# Altium project REFLOW_Controller.PrjPcb (part 2 of 3)

## Sheet MCU.SchDoc
size A4; SheetNumber: 3; SheetTotal: 5
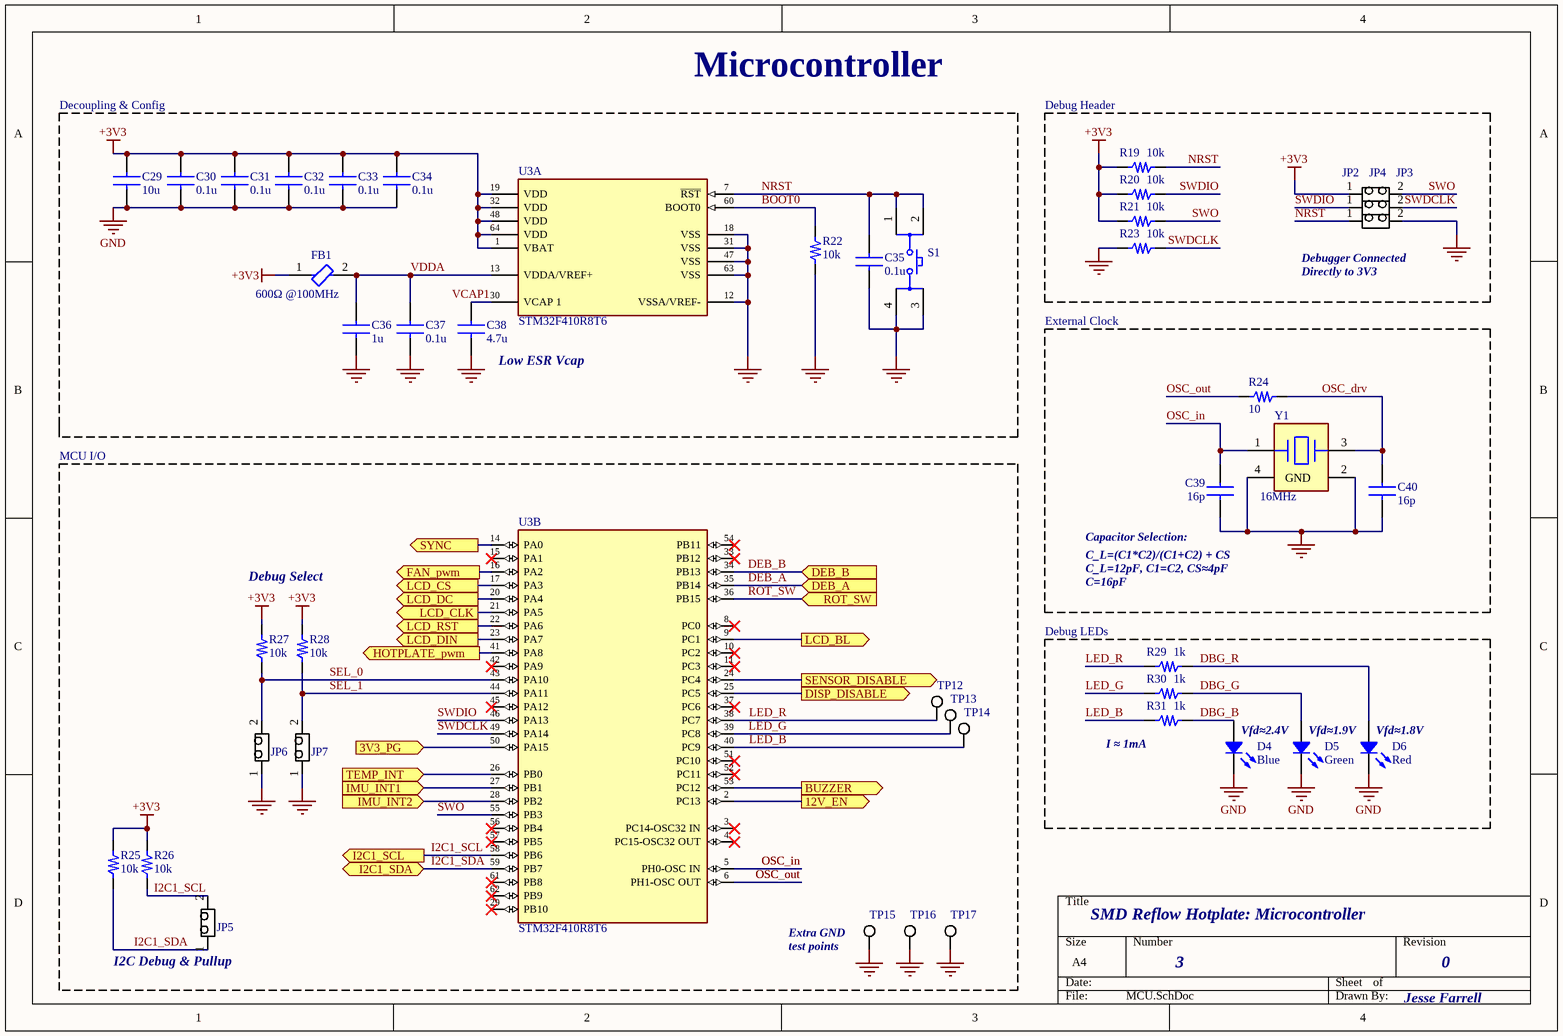
[diagram p2: MCU.SchDoc]

### Parts
C29  10u  [FP-CL10-IPC_C]
C30  0.1u  [FP-CL10-IPC_C]
C31  0.1u  [FP-CL10-IPC_C]
C32  0.1u  [FP-CL10-IPC_C]
C33  0.1u  [FP-CL10-IPC_C]
C34  0.1u  [FP-CL10-IPC_C]
C35  0.1u  [FP-CL10-IPC_C]
C36  1u  [FP-CL10-IPC_C]
C37  0.1u  [FP-CL10-IPC_C]
C38  4.7u  [FP-CL10-IPC_C]
C39  16p  [FP-CL10-IPC_C]
C40  16p  [FP-CL10-IPC_C]
D4  Blue  [LED 0603_1608 BLUE]
D5  Green  [LED 0603_1608 GREEN]
D6  Red  [LED 0603_1608 RED]
FB1  600Ω @100MHz  [FP-BLM18-0_15-t0_8-MFG]
JP2  HDR_1x2  [FP-TSW-102-07-L-S-MFG]  (value not drawn)
JP3  HDR_1x2  [FP-TSW-102-07-L-S-MFG]  (value not drawn)
JP4  HDR_1x2  [FP-TSW-102-07-L-S-MFG]  (value not drawn)
JP5  HDR_1x2  [FP-TSW-102-07-L-S-MFG]  (value not drawn)
JP6  HDR_1x2  [FP-TSW-102-07-L-S-MFG]  (value not drawn)
JP7  HDR_1x2  [FP-TSW-102-07-L-S-MFG]  (value not drawn)
R19  10k  [FP-RMCF0603-MFG]
R20  10k  [FP-RMCF0603-MFG]
R21  10k  [FP-RMCF0603-MFG]
R22  10k  [FP-RMCF0603-MFG]
R23  10k  [FP-RMCF0603-MFG]
R24  10  [FP-RMCF0603-MFG]
R25  10k  [FP-RMCF0603-MFG]
R26  10k  [FP-RMCF0603-MFG]
R27  10k  [FP-RMCF0603-MFG]
R28  10k  [FP-RMCF0603-MFG]
R29  1k  [FP-RMCF0603-MFG]
R30  1k  [FP-RMCF0603-MFG]
R31  1k  [FP-RMCF0603-MFG]
S1  PushButton  [FP-TL3301AF160QG-MFG]  (value not drawn)
TP12  TEST POINT  [KSTN-5003]  (value not drawn)
TP13  TEST POINT  [KSTN-5003]  (value not drawn)
TP14  TEST POINT  [KSTN-5003]  (value not drawn)
TP15  BLCK TEST POINT  [FP-5001-MFG]  (value not drawn)
TP16  BLCK TEST POINT  [FP-5001-MFG]  (value not drawn)
TP17  BLCK TEST POINT  [FP-5001-MFG]  (value not drawn)
U3  STM32F410R8T6  [FP-LQFP64-5W-IPC_B]  (parts A,B of 2)
Y1  16MHz  [FP-8Y-MFG]

### Blocks framed on the sheet
Debug Header: JP2-JP4 R19-R21 R23
Debug LEDs: D4-D6 R29-R31

### Ports
3V3_PG (in), 12V_EN (out), BUZZER (out), DEB_A (in), DEB_B (in), DISP_DISABLE (out), FAN_pwm (out), HOTPLATE_pwm (out), I2C1_SCL (out), I2C1_SDA (bidir), IMU_INT1 (in), IMU_INT2 (in), LCD_BL (out), LCD_CLK (out), LCD_CS (out), LCD_DC (out), LCD_DIN (out), LCD_RST (out), ROT_SW (in), SENSOR_DISABLE (out), SYNC (out), TEMP_INT (in)

### Nets
+3V3: C29.1 C30.1 C31.1 C32.1 C33.1 C34.1 FB1.1 JP2.1 R19.2 R20.2 R21.2 R25.2 R26.2 R27.2 R28.2 U3.1(VBAT) U3.19(VDD) U3.32(VDD) U3.48(VDD) U3.64(VDD)
GND: C29.2 C30.2 C31.2 C32.2 C33.2 C34.2 C35.2 C36.2 C37.2 C38.2 C39.2 C40.2 D4.2 D5.2 D6.2 JP4.2 JP6.1 JP7.1 R22.1 R23.2 S1.3 S1.4 TP15.1 TP16.1 TP17.1 U3.12(VSSA/VREF-) U3.18(VSS) U3.31(VSS) U3.47(VSS) U3.63(VSS) Y1.2(GND) Y1.4(GND)
3V3_PG: U3.50(PA15) ; port 3V3_PG
12V_EN_in: U3.2(PC13) ; port 12V_EN
BOOT0: R22.2 U3.60(BOOT0)
BUZZER: U3.53(PC12) ; port BUZZER
DBG_B: D4.1 R31.1
DBG_G: D5.1 R30.1
DBG_R: D6.1 R29.1
DEB_A: U3.35(PB14) ; port DEB_A
DEB_B: U3.34(PB13) ; port DEB_B
DISP_DBL: U3.25(PC5) ; port DISP_DISABLE
FAN_pwm: U3.16(PA2) ; port FAN_pwm
I2C1_SCL: JP5.2 R26.1 U3.58(PB6) ; port I2C1_SCL
I2C1_SDA: JP5.1 R25.1 U3.59(PB7) ; port I2C1_SDA
IMU_INT1: U3.27(PB1) ; port IMU_INT1
IMU_INT2: U3.28(PB2) ; port IMU_INT2
LCD_BL: U3.9(PC1) ; port LCD_BL
LCD_CLK: U3.21(PA5) ; port LCD_CLK
LCD_CS: U3.17(PA3) ; port LCD_CS
LCD_DC: U3.20(PA4) ; port LCD_DC
LCD_DIN: U3.23(PA7) ; port LCD_DIN
LCD_RST: U3.22(PA6) ; port LCD_RST
LED_B: R31.2 TP14.1 U3.40(PC9)
LED_G: R30.2 TP13.1 U3.39(PC8)
LED_R: R29.2 TP12.1 U3.38(PC7)
NRST: C35.1 JP4.1 R19.1 S1.1 S1.2 U3.7(~{RST})
OSC_drv: C40.1 R24.1 Y1.3
OSC_in: C39.1 U3.5(PH0-OSC_IN) Y1.1
OSC_out: R24.2 U3.6(PH1-OSC_OUT)
PLATE_pwm: U3.41(PA8) ; port HOTPLATE_pwm
ROT_SW: U3.36(PB15) ; port ROT_SW
SEL_0: JP6.2 R27.1 U3.43(PA10)
SEL_1: JP7.2 R28.1 U3.44(PA11)
SNS_DBL: U3.24(PC4) ; port SENSOR_DISABLE
SWDCLK: JP3.2 R23.1 U3.49(PA14)
SWDIO: JP3.1 R20.1 U3.46(PA13)
SWO: JP2.2 R21.1 U3.55(PB3)
SYNC_in: U3.14(PA0) ; port SYNC
TEMP_INT: U3.26(PB0) ; port TEMP_INT
VCAP1: C38.1 U3.30(VCAP_1)
VDDA: C36.1 C37.1 FB1.2 U3.13(VDDA/VREF+)

Not connected (* = marked no-connect by the designer): U3 3(PC14-OSC32_IN)* 4(PC15-OSC32_OUT)* 8(PC0)* 10(PC2)* 11(PC3)* 15(PA1)* 29(PB10)* 33(PB12)* 37(PC6)* 42(PA9)* 45(PA12)* 51(PC10)* 52(PC11)* 54(PB11)* 56(PB4)* 57(PB5)* 61(PB8)* 62(PB9)*

### Notes on the sheet
- Decoupling & Config
- Microcontroller
- Debugger Connected
  Directly to 3V3
- Low ESR Vcap
- External Clock
- MCU I/O
- Debug Select
- (near C39) Capacitor Selection: <https://www.st.com/resource/en/application_note/cd00221665-oscillator-design-guide-for-stm8afals-stm32-mcus-and-mpus-stmicroelectronics.pdf>
- C_L=(C1*C2)/(C1+C2) + CS
  C_L=12pF, C1=C2, CS≈4pF
  C=16pF
- (near R31) I ≈ 1mA
- (near D5) Vfd≈2.4V
- (near D6) Vfd≈1.9V
- (near D6) Vfd≈1.8V
- (near JP5) I2C Debug & Pullup
- (near TP15) Extra GND
  test points
- SMD Reflow Hotplate: Microcontroller
- 3
- 0
- Jesse Farrell

### Library data of the parts
C29 = CapTemplate0603: Cap Ceramic 10uF 16V X5R 10% SMD 0603; Capacitance: 0.1uF; Supplier 1: Digi-Key; RoHS: Yes; Category: Ceramic Capacitors; Mount: Surface Mount; Case/Package: 0603; Case Code (Metric): 1608; Case Code (Imperial): 0603; Packaging: Tape and Reel; Voltage Rating: 16V; Tolerance: 10%; Length: 0.063inch; Width: 0.031inch; Thickness: 0.035inch; ComponentLink1Description: DigikeyPart; ComponentLink1URL: https://www.digikey.ca/en/products/detail/samsung-electro-mechanics/CL10B104KO8NNNC/3886663
C30-C35 C37 = CapTemplate0603: Cap Ceramic 0.1uF 16V X7R 10% SMD 0603; Supplier 1: Digi-Key; RoHS: Yes; Category: Ceramic Capacitors; Mount: Surface Mount; Case/Package: 0603; Case Code (Metric): 1608; Case Code (Imperial): 0603; Packaging: Tape and Reel; Capacitance: 0.1uF; Voltage Rating: 16V; Tolerance: 10%; Length: 0.063inch; Width: 0.031inch; Thickness: 0.035inch; ComponentLink1Description: DigikeyPart; ComponentLink1URL: https://www.digikey.ca/en/products/detail/samsung-electro-mechanics/CL10B104KO8NNNC/3886663
C36 = CapTemplate0603: Cap Ceramic 1uF 16V X5R 10% SMD 0603; Supplier 1: Digi-Key; RoHS: Yes; Category: Ceramic Capacitors; Mount: Surface Mount; Case/Package: 0603; Case Code (Metric): 1608; Case Code (Imperial): 0603; Packaging: Tape and Reel; Capacitance: 1uF; Voltage Rating: 16V; Tolerance: 10%; Length: 0.063inch; Width: 0.031inch; Thickness: 0.035inch; ComponentLink1Description: DigikeyPart; ComponentLink1URL: https://www.digikey.ca/en/products/detail/samsung-electro-mechanics/CL10B104KO8NNNC/3886663
C38 = CapTemplate0603: Cap Ceramic 4.7uF 16V X5R 10% SMD 0603; Supplier 1: Digi-Key; RoHS: Yes; Category: Ceramic Capacitors; Mount: Surface Mount; Case/Package: 0603; Case Code (Metric): 1608; Case Code (Imperial): 0603; Packaging: Tape and Reel; Capacitance: 4.7uF; Voltage Rating: 16V; Tolerance: 10%; Length: 0.063inch; Width: 0.031inch; Thickness: 0.035inch
C39 C40 = CapTemplate0603: Cap Ceramic 16p 10V X7R 10% SMD 0603; Capacitance: ??uF; Voltage Rating: ??V; Tolerance: ??%; Supplier 1: Digi-Key; RoHS: Yes; Category: Ceramic Capacitors; Mount: Surface Mount; Case/Package: 0603; Case Code (Metric): 1608; Case Code (Imperial): 0603; Packaging: Tape and Reel; Length: 0.063inch; Width: 0.031inch; Thickness: 0.035inch
D4 = AA1608QBS/D-10MAV: 1.6X0.8MM BLUE SMD LED; Manufacturer: Kingbright; Current - Test: 10mA; Lens Color: Colorless; Lens Size: 1.40mm x 0.80mm; Lens Style: Rectangle with Flat Top; Lens Transparency: Clear; Millicandela Rating: 80mcd; Viewing Angle: 120°; Voltage - Forward (Vf) (Typ): 3V; Wavelength - Dominant: 465nm; Wavelength - Peak: 460nm; Part Number: AA1608QBS/D-10MAV; Color: Blue; ComponentLink1Description: Datasheet; ComponentLink1URL: https://www.kingbrightusa.com/images/catalog/SPEC/AA1608QBS-D-10MAV.pdf; ComponentLink2Description: DigiKey Link; ComponentLink2URL: https://www.digikey.com/en/products/detail/kingbright/AA1608QBS-D-10MAV/13997416; Device Package: 0603 (1608 Metric); Height (Max): 0.65mm; LastUpdated: 2022-06-14 9:41:25 PM; Lifecycle Status: Active; Minimum Order: 1; Mounting Type: Surface Mount; Package / Case: 0603 (1608 Metric); Packaging: TapeAndReel; PartId: 972; Part Status: Active; Price: 0.12; Series: -; Size / Dimension: 1.60mm L x 0.80mm W; Supplier 1: DigiKey; Supplier Part Number 1: 754-AA1608QBS/D-10MAVCT-ND; Supplier Device Package: 0603; Value: Blue
D5 = AA1608CGSK: 1.6X0.8MM GREEN SMD LED; Manufacturer: Kingbright; Current - Test: 20mA; Lens Color: Colorless; Lens Style: Rectangle with Flat Top; Lens Transparency: Clear; Millicandela Rating: 75mcd; Viewing Angle: 120°; Voltage - Forward (Vf) (Typ): 2.1V; Wavelength - Dominant: 570nm; Wavelength - Peak: 574nm; Part Number: AA1608CGSK; Color: Green; ComponentLink1Description: Datasheet; ComponentLink1URL: https://www.kingbrightusa.com/images/catalog/SPEC/AA1608CGSK.pdf; ComponentLink2Description: DigiKey Link; ComponentLink2URL: https://www.digikey.com/en/products/detail/kingbright/AA1608CGSK/13679426; Device Package: 0603 (1608 Metric); Height (Max): 0.70mm; LastUpdated: 2022-06-12 5:46:55 PM; Lifecycle Status: Active; Minimum Order: 1; Mounting Type: Surface Mount; Package / Case: 0603 (1608 Metric); Packaging: TapeAndReel; PartId: 995; Part Status: Active; Price: 0.12; Series: -; Size / Dimension: 1.60mm L x 0.80mm W; Supplier 1: DigiKey; Supplier Part Number 1: 754-AA1608CGSKCT-ND; Supplier Device Package: 0603; Value: Green
D6 = AA1608SURSK: 1.6X0.8MM RED SMD LED; Manufacturer: Kingbright; Current - Test: 20mA; Lens Color: Colorless; Lens Style: Rectangle with Flat Top; Lens Transparency: Clear; Millicandela Rating: 480mcd; Viewing Angle: 120°; Voltage - Forward (Vf) (Typ): 1.95V; Wavelength - Dominant: 630nm; Wavelength - Peak: 645nm; Part Number: AA1608SURSK; Color: Red; ComponentLink1Description: Datasheet; ComponentLink1URL: https://www.kingbrightusa.com/images/catalog/SPEC/AA1608SURSK.pdf; ComponentLink2Description: DigiKey Link; ComponentLink2URL: https://www.digikey.com/en/products/detail/kingbright/AA1608SURSK/13679445; Device Package: 0603 (1608 Metric); Height (Max): 0.70mm; LastUpdated: 2022-06-14 9:41:53 PM; Lifecycle Status: Active; Minimum Order: 1; Mounting Type: Surface Mount; Package / Case: 0603 (1608 Metric); Packaging: TapeAndReel; PartId: 1013; Part Status: Active; Price: 0.12; Series: -; Size / Dimension: 1.60mm L x 0.80mm W; Supplier 1: DigiKey; Supplier Part Number 1: 754-AA1608SURSKCT-ND; Supplier Device Package: 0603; Value: Red
FB1 = 782633601: Ferrite Bead, Aec-Q200, 600 Ohm, 0603 Rohs Compliant: Yes; Manufacturer: Wurth Electronics; Number of Lines: 1; Max Current Rating: 1A; DC Resistance (DCR): 200mR; Supplier 1: Digi-Key; Manufacturer Part Number: 782633601; RoHS: Yes; Category: Ferrite Beads and Chips; Stock 1: 21300; Mount: Surface Mount; Case/Package: 0603; Case Code (Metric): 1608; Case Code (Imperial): 0603; Min Operating Temperature: -55°C; Max Operating Temperature: 125°C; Package Quantity: 4000; Packaging: Tape and Reel; Length: 0.063inch; Width: 0.031inch; Height: 0.039inch; Ratings: AEC-Q200; RoHS Compliant: No; ComponentLink1URL: https://media.digikey.com/pdf/Data%20Sheets/Wurth%20Electronics%20PDFs/Q+_Products_Flyer.pdf?src-supplier=Digi-Key; ComponentLink1Description: https://media.digikey.com/pdf/Data%20Sheets/Wurth%20Electronics%20PDFs/Q+_Products_Flyer.pdf?src-supplier=Digi-Key; ComponentLink2URL: http://katalog.we-online.de/pbs/datasheet/782633601.pdf?src-supplier=Digi-Key; ComponentLink2Description: http://katalog.we-online.de/pbs/datasheet/782633601.pdf?src-supplier=Digi-Key; Supplier Part Number 1: 732-6703-1-ND
JP2-JP7 = PH1-02-UA: Conn Unshrouded Header HDR 2 POS 2.54mm Solder ST Thru-Hole Bag; Manufacturer: Adam Equipment; Current Rating: 3A; Voltage Rating: 250V; Number of Positions: 2; Supplier 1: Digi-Key; Manufacturer Part Number: PH1-02-UA; RoHS: Yes; Category: Connectors; Stock 1: 124311; Contact Material: Brass; Contact Plating: Gold; Housing Material: PBT; Contact Gender: Male; Number of Rows: 1; Termination: Solder; Pitch: 2.54mm; Lead Free: Lead Free; ComponentLink1URL: https://datasheet.ciiva.com/16392/ph1-xx-ua-16392701.pdf?src-supplier=Future+Electronics; ComponentLink1Description: https://datasheet.ciiva.com/16392/ph1-xx-ua-16392701.pdf?src-supplier=Future+Electronics; ComponentLink2URL: https://datasheet.ciiva.com/5160/page-292-295-12946-5160830.pdf?src-supplier=Mouser; ComponentLink2Description: https://datasheet.ciiva.com/5160/page-292-295-12946-5160830.pdf?src-supplier=Mouser; Supplier Part Number 1: 2057-PH1-02-UA-ND
R19-R23 R25-R28 = ResTemplate0603: Res 0603 10K Ohm 1% 1/10W; Tolerance: ???%; Power Rating: ???mW; Resistance: ???; Supplier 1: Digi-Key; Category: Chip SMD Resistors; Mount: Surface Mount; Case/Package: 0603; Case Code (Metric): 1608; Case Code (Imperial): 0603; Number of Terminations: 2; Length: 0.061inch; Width: 0.031inch; Height: 0.022inch
R24 = ResTemplate0603: Res 0603 10 Ohm 1% 1/10W; Tolerance: ???%; Power Rating: ???mW; Resistance: ???; Supplier 1: Digi-Key; Category: Chip SMD Resistors; Mount: Surface Mount; Case/Package: 0603; Case Code (Metric): 1608; Case Code (Imperial): 0603; Number of Terminations: 2; Length: 0.061inch; Width: 0.031inch; Height: 0.022inch
R29-R31 = ResTemplate0603: Res 0603 1K Ohm 1% 1/8W; Tolerance: ???%; Power Rating: ???mW; Resistance: ???; Supplier 1: Digi-Key; Category: Chip SMD Resistors; Mount: Surface Mount; Case/Package: 0603; Case Code (Metric): 1608; Case Code (Imperial): 0603; Number of Terminations: 2; Length: 0.061inch; Width: 0.031inch; Height: 0.022inch
S1 = PTS645SL43SMTR92LFS: Switch Tactile N.O. SPST Round Button Gull Wing 0.05A 12VDC 100000Cycles 1.27N SMD T/R; Manufacturer: ITT C&K; Actuator Material: Nylon,Polyamide,PA66; Max Voltage Rating (DC): 12V; Contact Resistance: 100mR; Max Current Rating: 50mA; Illumination Type: Non-Illuminated; Switch Function: Off-Mom; Actuator Type: Standard; Actuator Length: 0.85mm; Supplier 1: Digi-Key; Manufacturer Part Number: PTS645SL43SMTR92LFS; RoHS: Yes; Category: Tactile Switches; Stock 1: 20686; Mount: Surface Mount; Contact Material: Bronze,Brass,Silver; Contact Plating: Silver; Mechanical Life: 100000Cycles; Color: Black; Min Operating Temperature: -20°C; Max Operating Temperature: 60°C; Throw Configuration: SPST; Operating Force: 1.27N; Packaging: Tape and Reel; Termination: Gull Wing; Voltage Rating (DC): 12V; Package Quantity: 1000; Current Rating: 50mA; Orientation: Straight; Series: PTS645; Length: 6mm; Depth: 9mm; Size: 6mm; Lead Free: Lead Free; RoHS Compliant: Yes; ComponentLink1URL: https://datasheet.ciiva.com/26927/getdatasheetpartid-774114-26927132.pdf?src-supplier=Verical; ComponentLink1Description: https://datasheet.ciiva.com/26927/getdatasheetpartid-774114-26927132.pdf?src-supplier=Verical; Supplier Part Number 1: CKN10880CT-ND
TP12-TP14 = 5003: Test Point;  Miniature;  THM;  H .300;  Nylon 46 Insulated Orange;  PhosBronze/Silver; Manufacturer: Keystone Electronics; Body Material: PBT; Plating: Silver; Inside Diameter: 1.27mm; Outside Diameter: 2.54mm; Supplier 1: Digi-Key; Manufacturer Part Number: 5003; RoHS: Yes; Category: Connectors; Stock 1: 166018; Mount: PCB,Through Hole; Number of Pins: 1; Contact Material: Bronze; Contact Plating: Silver,Tin; Material: Nylon,Bronze,Silver; Color: Orange,White; Package Quantity: 10; Packaging: Bulk; Series: THM; Termination: Through Hole; Length: 7.62mm; Height: 0.3inch; REACH SVHC: No SVHC; Lead Free: Lead Free; RoHS Compliant: Yes; Flammability Rating: UL94 V-0; ComponentLink1URL: https://datasheet.ciiva.com/16885/70182825-16885788.pdf?src-supplier=Allied+Electronics; ComponentLink1Description: https://datasheet.ciiva.com/16885/70182825-16885788.pdf?src-supplier=Allied+Electronics; ComponentLink2URL: https://datasheet.ciiva.com/1454/1703983-1454826.pdf?src-supplier=Element14; ComponentLink2Description: https://datasheet.ciiva.com/1454/1703983-1454826.pdf?src-supplier=Element14; ComponentLink3URL: https://datasheet.ciiva.com/22631/1703983-22631103.pdf?src-supplier=Element14; ComponentLink3Description: https://datasheet.ciiva.com/22631/1703983-22631103.pdf?src-supplier=Element14; ComponentLink4URL: https://datasheet.ciiva.com/4598/5000-5004-4598618.pdf?src-supplier=Mouser; ComponentLink4Description: https://datasheet.ciiva.com/4598/5000-5004-4598618.pdf?src-supplier=Mouser; Supplier Part Number 1: 36-5003-ND
TP15-TP17 = 5001: TEST POINT PC MINI .040D BLACK; Manufacturer: Keystone Electronics; Body Material: Bronze; Plating: Silver; Number of Ports: 1; Insulation: Insulated; Inside Diameter: 1.27mm; Outside Diameter: 2.54mm; Hole Diameter: 1.6mm; Supplier 1: Digi-Key; Manufacturer Part Number: 5001; RoHS: Yes; Category: Test Probes, Leads and Clips; Stock 1: 1368499; Mount: Through Hole; Contact Material: Bronze; Contact Plating: Silver,Tin; Material: Nylon,Bronze,Silver; Color: Black; Insulation Material: Nylon; Housing Color: Black; Package Quantity: 100; Packaging: Bulk; Series: THM; Termination: Through Hole; Orientation: Straight; Number of Contacts: 1; Diameter: 2.54mm; Length: 7.62mm; Height: 0.3inch; REACH SVHC: No SVHC; Lead Free: Lead Free; RoHS Compliant: Yes; Flammability Rating: UL94 V-0; ComponentLink1URL: https://datasheet.ciiva.com/11836/0900766b8009b7c7-11836045.pdf?src-supplier=RSComponents; ComponentLink1Description: https://datasheet.ciiva.com/11836/0900766b8009b7c7-11836045.pdf?src-supplier=RSComponents; ComponentLink2URL: https://datasheet.ciiva.com/27052/1581986-27052611.pdf?src-supplier=Jameco; ComponentLink2Description: https://datasheet.ciiva.com/27052/1581986-27052611.pdf?src-supplier=Jameco; ComponentLink3URL: https://datasheet.ciiva.com/16318/m60-2p60-16318423.pdf?src-supplier=Future+Electronics; ComponentLink3Description: https://datasheet.ciiva.com/16318/m60-2p60-16318423.pdf?src-supplier=Future+Electronics; ComponentLink4URL: https://datasheet.ciiva.com/22631/1703983-22631100.pdf?src-supplier=Element14; ComponentLink4Description: https://datasheet.ciiva.com/22631/1703983-22631100.pdf?src-supplier=Element14; Supplier Part Number 1: 36-5001-ND
U3 = STM32F410R8T6: MCU 32-bit ARM Cortex M4 RISC 64KB Flash 3.3V 64-Pin LQFP Frame; Manufacturer: STMicroelectronics; Interface: I2C,SPI,IrDA,UART,USART; Peripherals: Brown-out Detect/Reset,POR,PWM,WDT,DMA; Frequency: 100MHz; Number of I/Os: 50; Oscillator Type: Internal; Supplier 1: Digi-Key; Manufacturer Part Number: STM32F410R8T6; RoHS: Yes; Category: Microcontrollers; Case/Package: LQFP; Min Operating Temperature: -40°C; Max Operating Temperature: 85°C; Memory Type: FLASH; Packaging: Tray; Core Architecture: ARM; Memory Size: 64KB; RoHS Compliant: Yes; ComponentLink1URL: http://www.mouser.com/ds/2/389/stm32f410cb-956320.pdf?src-supplier=Mouser; ComponentLink1Description: http://www.mouser.com/ds/2/389/stm32f410cb-956320.pdf?src-supplier=Mouser; ComponentLink2URL: http://www.st.com/content/ccc/resource/technical/document/datasheet/6e/f3/b0/1b/05/eb/49/fe/DM00214043.pdf/files/DM00214043.pdf/jcr:content/translations/en.DM00214043.pdf?src-supplier=Digi-Key; ComponentLink2Description: http://www.st.com/content/ccc/resource/technical/document/datasheet/6e/f3/b0/1b/05/eb/49/fe/DM00214043.pdf/files/DM00214043.pdf/jcr:content/translations/en.DM00214043.pdf?src-supplier=Digi-Key; Supplier Part Number 1: 497-18544-ND
Y1 = Crystal_Template: Crystal Template for 4-SMD Crystal

## Sheet Sensors.SchDoc
size A4; SheetNumber: 4; SheetTotal: 5
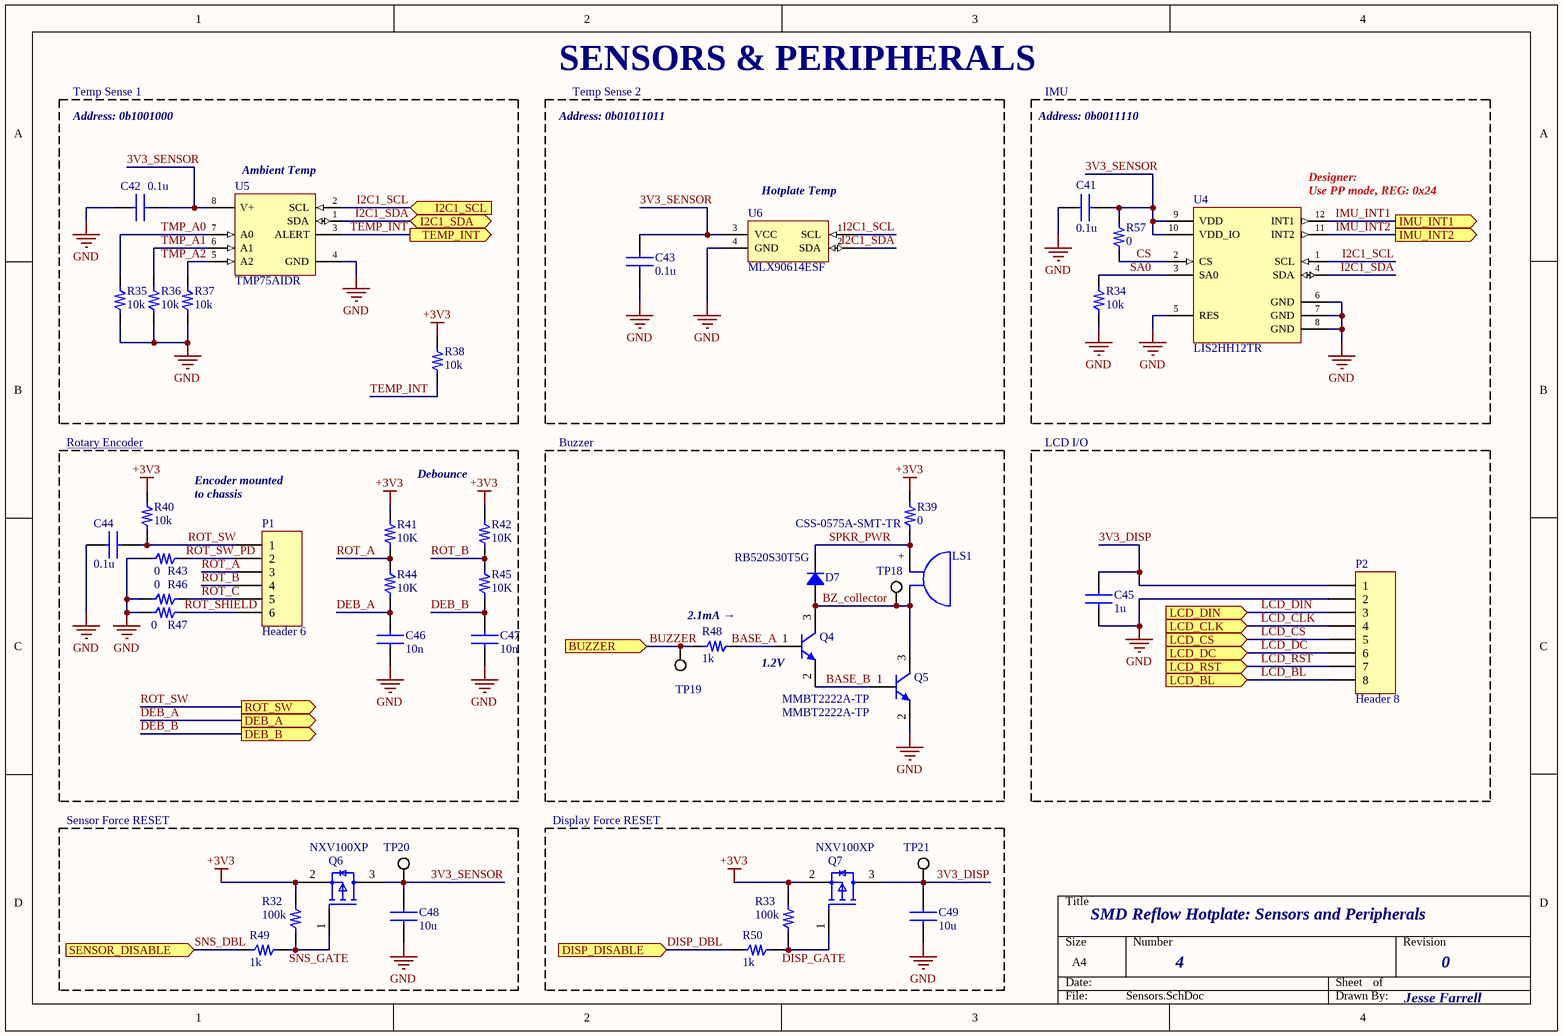
[diagram p3: Sensors.SchDoc]

### Parts
C41  0.1u  [FP-CL10-IPC_C]
C42  0.1u  [FP-CL10-IPC_C]
C43  0.1u  [FP-CL10-IPC_C]
C44  0.1u  [FP-CL10-IPC_C]
C45  1u  [FP-CL10-IPC_C]
C46  10n  [FP-CL10-IPC_C]
C47  10n  [FP-CL10-IPC_C]
C48  10u  [FP-CL10-IPC_C]
C49  10u  [FP-CL10-IPC_C]
D7  RB520S30T5G  [SOD-523]
LS1  CSS-0575A-SMT-TR  [CUI CSS-0575A-SMT-TR]
P1  Header 6  [HDR1X6]
P2  Header 8  [HDR1X8]
Q4  MMBT2222A-TP  [MCCSEMI SOT-23-3]
Q5  MMBT2222A-TP  [MCCSEMI SOT-23-3]
Q6  NXV100XP  [FP-SOT23-MFG - duplicate]
Q7  NXV100XP  [FP-SOT23-MFG - duplicate]
R32  100k  [FP-RMCF0603-MFG]
R33  100k  [FP-RMCF0603-MFG]
R34  10k  [FP-RMCF0603-MFG]
R35  10k  [FP-RMCF0603-MFG]
R36  10k  [FP-RMCF0603-MFG]
R37  10k  [FP-RMCF0603-MFG]
R38  10k  [FP-RMCF0603-MFG]
R39  0  [FP-RMCF0603-MFG]
R40  10k  [FP-RMCF0603-MFG]
R41  10K  [FP-RMCF0603-MFG]
R42  10K  [FP-RMCF0603-MFG]
R43  0  [FP-RMCF0603-MFG]
R44  10K  [FP-RMCF0603-MFG]
R45  10K  [FP-RMCF0603-MFG]
R46  0  [FP-RMCF0603-MFG]
R47  0  [FP-RMCF0603-MFG]
R48  1k  [FP-RMCF0603-MFG]
R49  1k  [FP-RMCF0603-MFG]
R50  1k  [FP-RMCF0603-MFG]
R57  0  [FP-RMCF0603-MFG]
TP18  TEST POINT  [KSTN-5003]  (value not drawn)
TP19  TEST POINT  [KSTN-5003]  (value not drawn)
TP20  TEST POINT  [KSTN-5003]  (value not drawn)
TP21  TEST POINT  [KSTN-5003]  (value not drawn)
U4  LIS2HH12TR  [STM-LGA-12]
U5  TMP75AIDR  [FP-D0008A-MFG]
U6  MLX90614ESF  [TO254P942H425-4]

### Blocks framed on the sheet
Temp Sense 1: C42 R35-R38 U5
Temp Sense 2: C43 U6
IMU: C41 R34 R57 U4
Rotary Encoder: C44 C46 C47 P1 R40-R47
Buzzer: D7 LS1 Q4 Q5 R39 R48 TP18 TP19
LCD I/O: C45 P2
Sensor Force RESET: C48 Q6 R32 R49 TP20
Display Force RESET: C49 Q7 R33 R50 TP21

### Ports
BUZZER (in), DEB_A (out), DEB_B (out), DISP_DISABLE (in), I2C1_SCL (in), I2C1_SDA (bidir), IMU_INT1 (out), IMU_INT2 (out), LCD_BL (in), LCD_CLK (in), LCD_CS (in), LCD_DC (in), LCD_DIN (in), LCD_RST (in), ROT_SW (out), SENSOR_DISABLE (in), TEMP_INT (out)

### Nets
+3V3: Q6.2(S) Q7.2(S) R32.2 R33.2 R38.1 R39.1 R40.1 R41.2 R42.2
GND: C41.1 C42.1 C43.1 C44.1 C45.1 C46.1 C47.1 C48.2 C49.2 P2.2 Q5.2(E) R34.2 R35.2 R36.2 R37.2 R43.1 R46.1 R47.1 U4.5(RES) U4.6(GND) U4.7(GND) U4.8(GND) U5.4(GND) U6.4(GND)
3V3_DISP: C45.2 C49.1 P2.1 Q7.3(D) TP21.1
3V3_SENSOR: C41.2 C42.2 C43.2 C48.1 Q6.3(D) R57.2 TP20.1 U4.9(VDD) U4.10(VDD_IO) U5.8(V+) U6.3(VCC)
BASE_A: Q4.1(B) R48.1
BASE_B: Q4.2(E) Q5.1(B)
BUZZER: R48.2 TP19.1 ; port BUZZER
BZ_collector: D7.1 LS1.- Q4.3(C) Q5.3(C) TP18.1
CS: R57.1 U4.2(CS)
DEB_A: C46.2 R44.2 ; port DEB_A
DEB_B: C47.2 R45.2 ; port DEB_B
DISP_DBL: R50.2 ; port DISP_DISABLE
DISP_GATE: Q7.1(G) R33.1 R50.1
I2C1_SCL: U4.1(SCL) U5.2(SCL) U6.1(SCL) ; port I2C1_SCL
I2C1_SDA: U4.4(SDA) U5.1(SDA) U6.2(SDA) ; port I2C1_SDA
IMU_INT1: U4.12(INT1) ; port IMU_INT1
IMU_INT2: U4.11(INT2) ; port IMU_INT2
LCD_BL: P2.8 ; port LCD_BL
LCD_CLK: P2.4 ; port LCD_CLK
LCD_CS: P2.5 ; port LCD_CS
LCD_DC: P2.6 ; port LCD_DC
LCD_DIN: P2.3 ; port LCD_DIN
LCD_RST: P2.7 ; port LCD_RST
ROT_A: P1.3 R41.1 R44.1
ROT_B: P1.4 R42.1 R45.1
ROT_C: P1.5 R46.2
ROT_SHIELD: P1.6 R47.2
ROT_SW: C44.2 P1.1 R40.2 ; port ROT_SW
ROT_SW_PD: P1.2 R43.2
SA0: R34.1 U4.3(SA0)
SNS_DBL: R49.2 ; port SENSOR_DISABLE
SNS_GATE: Q6.1(G) R32.1 R49.1
SPKR_PWR: D7.2 LS1.+ R39.2
TEMP_INT: R38.2 U5.3(ALERT) ; port TEMP_INT
TMP_A0: R35.1 U5.7(A0)
TMP_A1: R36.1 U5.6(A1)
TMP_A2: R37.1 U5.5(A2)

### Notes on the sheet
- SENSORS & PERIPHERALS
- Address: 0b1001000
- (near U5) Ambient Temp
- Address: 0b01011011
- Address: 0b0011110
- (near U6) Hotplate Temp
- (near U4) Designer:
  Use PP mode, REG: 0x24
- Encoder mounted
  to chassis
- Debounce
- 2.1mA →
- (near Q4) 1.2V
- SMD Reflow Hotplate: Sensors and Peripherals
- 4
- 0
- Jesse Farrell

### Library data of the parts
C41-C44 = CapTemplate0603: Cap Ceramic 0.1uF 16V X7R 10% SMD 0603; Supplier 1: Digi-Key; RoHS: Yes; Category: Ceramic Capacitors; Mount: Surface Mount; Case/Package: 0603; Case Code (Metric): 1608; Case Code (Imperial): 0603; Packaging: Tape and Reel; Capacitance: 0.1uF; Voltage Rating: 16V; Tolerance: 10%; Length: 0.063inch; Width: 0.031inch; Thickness: 0.035inch; ComponentLink1Description: DigikeyPart; ComponentLink1URL: https://www.digikey.ca/en/products/detail/samsung-electro-mechanics/CL10B104KO8NNNC/3886663
C45 = CapTemplate0603: Cap Ceramic 1uF 16V X5R 10% SMD 0603; Capacitance: 0.1uF; Supplier 1: Digi-Key; RoHS: Yes; Category: Ceramic Capacitors; Mount: Surface Mount; Case/Package: 0603; Case Code (Metric): 1608; Case Code (Imperial): 0603; Packaging: Tape and Reel; Voltage Rating: 16V; Tolerance: 10%; Length: 0.063inch; Width: 0.031inch; Thickness: 0.035inch; ComponentLink1Description: DigikeyPart; ComponentLink1URL: https://www.digikey.ca/en/products/detail/samsung-electro-mechanics/CL10B104KO8NNNC/3886663
C46 C47 = CapTemplate0603: Cap Ceramic 10nF 16V X7R 10% SMD 0603; Supplier 1: Digi-Key; RoHS: Yes; Category: Ceramic Capacitors; Mount: Surface Mount; Case/Package: 0603; Case Code (Metric): 1608; Case Code (Imperial): 0603; Packaging: Tape and Reel; Capacitance: 10nF; Voltage Rating: 16V; Tolerance: 10%; Length: 0.063inch; Width: 0.031inch; Thickness: 0.035inch; ComponentLink1Description: DigikeyPart; ComponentLink1URL: https://www.digikey.ca/en/products/detail/samsung-electro-mechanics/CL10B104KO8NNNC/3886663
C48 C49 = CapTemplate0603: as C29 on sheet MCU; Supplier 1: Digi-Key; RoHS: Yes; Category: Ceramic Capacitors; Mount: Surface Mount; Case/Package: 0603; Case Code (Metric): 1608; Case Code (Imperial): 0603; Packaging: Tape and Reel; Voltage Rating: 16V; Tolerance: 10%; Length: 0.063inch; Width: 0.031inch; Thickness: 0.035inch; ComponentLink1Description: DigikeyPart; ComponentLink1URL: https://www.digikey.ca/en/products/detail/samsung-electro-mechanics/CL10B104KO8NNNC/3886663
D7 = RB520S30T5G: DIODE SCHOTTKY 30V 200MA SOD523; Manufacturer: ON Semiconductor; Current - Average Rectified (Io): 200mA (DC); Current - Reverse Leakage @ Vr: 1µA @ 10V; Speed: Small Signal =< 200mA (Io), Any Speed; Voltage - Forward (Vf) (Max) @ If: 600mV @ 200mA; Part Number: RB520S30T5G; ComponentLink1Description: Datasheet; ComponentLink1URL: https://www.onsemi.com/pub/Collateral/RB520S30T1-D.PDF; ComponentLink2Description: DigiKey Link; ComponentLink2URL: http://digikey.com/product-detail/en/on-semiconductor/RB520S30T5G/RB520S30T5GOSCT-ND/5213385; Diode Type: Schottky; LastUpdated: 2022-05-23 1:41:49 PM; Lifecycle Status: Active; Minimum Order: 1; Mounting Type: Surface Mount; Operating Temperature - Junction: -55°C ~ 150°C; Package / Case: SC-79, SOD-523; Packaging: TapeAndReel; PartId: 2811; Part Status: Active; Price: 0.02; Series: -; Supplier 1: DigiKey; Supplier Part Number 1: RB520S30T5GOSCT-ND; Supplier Device Package: SOD-523; Voltage - DC Reverse (Vr) (Max): 30V
LS1 = CSS-0575A-SMT-TR: AUDIO MAGNETIC XDCR 2-4V SMD; Manufacturer: CUI Devices; Current - Supply: 95mA; Driver Circuitry: Transducer, Externally Driven; Frequency: 4kHz; Input Type: Zero-Peak Signal; Operating Mode: Single Tone; Port Location: Top; Sound Pressure Level (SPL): 76dB @ 3V, 10cm; Voltage Range: 2 ~ 4V; Voltage - Rated: 3V; Part Number: CSS-0575A-SMT-TR; ComponentLink1Description: Datasheet; ComponentLink1URL: https://www.cuidevices.com/product/resource/digikeypdf/css-0575a-smt-tr.pdf; ComponentLink2Description: DigiKey Link; ComponentLink2URL: http://digikey.com/product-detail/en/cui-devices/CSS-0575A-SMT-TR/102-2201-1-ND/2364650; Height - Seated (Max): 0.094" (2.40mm); LastUpdated: 2020-04-24 12:39:31 AM; Lifecycle Status: Active; Minimum Order: 1; Mounting Type: Surface Mount; Operating Temperature: -30°C ~ 70°C; Packaging: TapeAndReel; Part Status: Active; Price: 1.50; Series: CSS; Size / Dimension: 0.197" L x 0.197" W (5.00mm x 5.00mm); Supplier 1: DigiKey; Supplier Part Number 1: 102-2201-1-ND; Technology: Magnetic; Termination: Solder Pads
P1 = Header 6: Header, 6-Pin; LatestRevisionDate: 17-Jul-2002; LatestRevisionNote: Re-released for DXP Platform.; Publisher: Altium Limited
P2 = Header 8: Header, 8-Pin; LatestRevisionDate: 17-Jul-2002; LatestRevisionNote: Re-released for DXP Platform.; Publisher: Altium Limited
Q4 Q5 = MMBT2222A-TP: TRANS NPN 40V 0.6A SOT23; Manufacturer: Micro Commercial Co; Current - Collector (Ic) (Max): 600 mA; DC Current Gain (hFE) (Min) @ Ic, Vce: 100 @ 150mA, 10V; Frequency - Transition: 300MHz; Power - Max: 350 mW; Vce Saturation (Max) @ Ib, Ic: 1V @ 50mA, 500mA; Part Number: MMBT2222A-TP; ComponentLink1Description: Datasheet; ComponentLink1URL: https://www.mccsemi.com/pdf/Products/MMBT2222A(SOT-23).pdf; ComponentLink2Description: DigiKey Link; ComponentLink2URL: https://www.digikey.com/en/products/detail/micro-commercial-co/MMBT2222A-TP/717279; LastUpdated: 2022-06-12 6:00:23 PM; Lifecycle Status: Active; Minimum Order: 1; Mounting Type: Surface Mount; Operating Temperature: -55°C ~ 150°C (TJ); Package / Case: TO-236-3, SC-59, SOT-23-3; Packaging: TapeAndReel; PartId: 259; Part Status: Active; Price: 0.02; Series: -; Supplier 1: DigiKey; Supplier Part Number 1: MMBT2222ATPMSCT-ND; Supplier Device Package: SOT-23; Transistor Type: NPN; Voltage - Collector Emitter Breakdown (Max): 40 V
Q6 Q7 = NXV100XPR: NXV100XP - 30 V, P-channel Trench MOSFET; Manufacturer: Nexperia; Supplier 1: Digi-Key; Manufacturer Part Number: NXV100XPR; RoHS: No; Category: Uncategorized; Stock 1: 1985; Supplier Part Number 1: 1727-NXV100XPRCT-ND
R32 R33 = ResTemplate0603: Res 0603 100K Ohm 1% 1/10W; Tolerance: ???%; Power Rating: ???mW; Resistance: ???; Supplier 1: Digi-Key; Category: Chip SMD Resistors; Mount: Surface Mount; Case/Package: 0603; Case Code (Metric): 1608; Case Code (Imperial): 0603; Number of Terminations: 2; Length: 0.061inch; Width: 0.031inch; Height: 0.022inch
R34-R38 R40-R42 R44 R45 = ResTemplate0603: as R19 on sheet MCU; Supplier 1: Digi-Key; Category: Chip SMD Resistors; Mount: Surface Mount; Case/Package: 0603; Case Code (Metric): 1608; Case Code (Imperial): 0603; Number of Terminations: 2; Length: 0.061inch; Width: 0.031inch; Height: 0.022inch
R39 R43 R46 R47 R57 = ResTemplate0603: Res 0603 0 Ohm 1% 1/10W; Tolerance: ???%; Power Rating: ???mW; Resistance: ???; Supplier 1: Digi-Key; Category: Chip SMD Resistors; Mount: Surface Mount; Case/Package: 0603; Case Code (Metric): 1608; Case Code (Imperial): 0603; Number of Terminations: 2; Length: 0.061inch; Width: 0.031inch; Height: 0.022inch
R48-R50 = ResTemplate0603: Res 0603 1K Ohm 1% 1/10W; Tolerance: ???%; Power Rating: ???mW; Resistance: ???; Supplier 1: Digi-Key; Category: Chip SMD Resistors; Mount: Surface Mount; Case/Package: 0603; Case Code (Metric): 1608; Case Code (Imperial): 0603; Number of Terminations: 2; Length: 0.061inch; Width: 0.031inch; Height: 0.022inch
TP18-TP21 = 5003: as TP12 on sheet MCU; Supplier 1: Digi-Key; Manufacturer Part Number: 5003; RoHS: Yes; Category: Connectors; Stock 1: 166018; Mount: PCB,Through Hole; Number of Pins: 1; Contact Material: Bronze; Contact Plating: Silver,Tin; Material: Nylon,Bronze,Silver; Color: Orange,White; Package Quantity: 10; Packaging: Bulk; Series: THM; Termination: Through Hole; Length: 7.62mm; Height: 0.3inch; REACH SVHC: No SVHC; Lead Free: Lead Free; RoHS Compliant: Yes; Flammability Rating: UL94 V-0; ComponentLink1URL: https://datasheet.ciiva.com/16885/70182825-16885788.pdf?src-supplier=Allied+Electronics; ComponentLink1Description: https://datasheet.ciiva.com/16885/70182825-16885788.pdf?src-supplier=Allied+Electronics; ComponentLink2URL: https://datasheet.ciiva.com/1454/1703983-1454826.pdf?src-supplier=Element14; ComponentLink2Description: https://datasheet.ciiva.com/1454/1703983-1454826.pdf?src-supplier=Element14; ComponentLink3URL: https://datasheet.ciiva.com/22631/1703983-22631103.pdf?src-supplier=Element14; ComponentLink3Description: https://datasheet.ciiva.com/22631/1703983-22631103.pdf?src-supplier=Element14; ComponentLink4URL: https://datasheet.ciiva.com/4598/5000-5004-4598618.pdf?src-supplier=Mouser; ComponentLink4Description: https://datasheet.ciiva.com/4598/5000-5004-4598618.pdf?src-supplier=Mouser; Supplier Part Number 1: 36-5003-ND
U4 = LIS2HH12TR: ACCELEROMETER 2-8G I2C/SPI 12LGA; Manufacturer: STMicroelectronics; Bandwidth: 400Hz; Output Type: SPI,I2C,Digital; Axis: X, Y, Z; Operating Supply Voltage: 3.6V; Supplier 1: Digi-Key; Manufacturer Part Number: LIS2HH12TR; RoHS: Yes; Category: Accelerometers; Stock 1: 6504; Mount: Surface Mount; Case/Package: LGA; Number of Pins: 12; Contact Plating: Gold; Min Operating Temperature: -40°C; Max Operating Temperature: 85°C; Packaging: Tape and Reel; Lead Free: Lead Free; RoHS Compliant: Yes; ComponentLink1URL: http://www.farnell.com/datasheets/2291204.pdf?src-supplier=Farnell; ComponentLink1Description: http://www.farnell.com/datasheets/2291204.pdf?src-supplier=Farnell; ComponentLink2URL: https://www.mouser.com/ds/2/389/lis2hh12-954953.pdf?src-supplier=Mouser; ComponentLink2Description: https://www.mouser.com/ds/2/389/lis2hh12-954953.pdf?src-supplier=Mouser; ComponentLink3URL: http://components.arrow.com/part/dataview/63232475S1079201N7728?src-supplier=Arrow+Electronics; ComponentLink3Description: http://components.arrow.com/part/dataview/63232475S1079201N7728?src-supplier=Arrow+Electronics; ComponentLink4URL: http://www.farnell.com/datasheets/2291204.pdf?src-supplier=Newark; ComponentLink4Description: http://www.farnell.com/datasheets/2291204.pdf?src-supplier=Newark; ComponentLink5URL: http://www.farnell.com/datasheets/2291204.pdf?src-supplier=Element14; ComponentLink5Description: http://www.farnell.com/datasheets/2291204.pdf?src-supplier=Element14; ComponentLink6URL: http://www.st.com/content/ccc/resource/technical/document/datasheet/c9/16/f2/79/ca/31/47/89/DM00096789.pdf/files/DM00096789.pdf/jcr:content/translations/en.DM00096789.pdf?src-supplier=Digi-Key; ComponentLink6Description: http://www.st.com/content/ccc/resource/technical/document/datasheet/c9/16/f2/79/ca/31/47/89/DM00096789.pdf/files/DM00096789.pdf/jcr:content/translations/en.DM00096789.pdf?src-supplier=Digi-Key; ComponentLink7URL: http://www.st.com/st-web-ui/static/active/en/resource/technical/document/datasheet/DM00096789.pdf?src-supplier=Avnet; ComponentLink7Description: http://www.st.com/st-web-ui/static/active/en/resource/technical/document/datasheet/DM00096789.pdf?src-supplier=Avnet; Supplier Part Number 1: 497-15069-1-ND
U5 = TMP75AIDR: Temperature Sensor Digital, Local -40°C ~ 125°C 11 b 8-SOIC; Manufacturer: Texas Instruments; Quiescent Current: 50uA; Min Supply Voltage: 2.7V; Max Supply Voltage: 5.5V; Interface: I2C,SMBus,2-Wire; Resolution: 12b; Operating Supply Current: 85uA; Number of Bits: 12; Output Current: 3mA; Nominal Supply Current: 410uA; Output Voltage: 400mV; Supplier 1: Digi-Key; Manufacturer Part Number: TMP75AIDR; RoHS: Yes; Category: Integrated Circuits (ICs); Mount: Surface Mount; Case/Package: SOIC; Number of Pins: 8; Weight: 0.002677oz; Contact Plating: Gold; Min Operating Temperature: -40°C; Max Operating Temperature: 125°C; Packaging: Tape and Reel; Package Quantity: 1; Max Supply Voltage (DC): 5.5V; Min Supply Voltage (DC): 2.7V; Output Type: Digital; Termination: SMD/SMT; Radiation Hardening: No; Lead Free: Lead Free; RoHS Compliant: Yes; REACH SVHC: No SVHC; ComponentLink1URL: https://datasheet.ciiva.com/15098/getdatasheetpartid-313967-15098447.pdf?src-supplier=Verical; ComponentLink1Description: https://datasheet.ciiva.com/15098/getdatasheetpartid-313967-15098447.pdf?src-supplier=Verical; ComponentLink2URL: https://datasheet.ciiva.com/46395/1836472-46395973.pdf?src-supplier=Element14; ComponentLink2Description: https://datasheet.ciiva.com/46395/1836472-46395973.pdf?src-supplier=Element14; ComponentLink3URL: https://datasheet.ciiva.com/2002/tmp175-2002986.pdf?src-supplier=Digi-Key; ComponentLink3Description: https://datasheet.ciiva.com/2002/tmp175-2002986.pdf?src-supplier=Digi-Key; ComponentLink4URL: https://datasheet.ciiva.com/2002/tmp175-2002985.pdf?src-supplier=Digi-Key; ComponentLink4Description: https://datasheet.ciiva.com/2002/tmp175-2002985.pdf?src-supplier=Digi-Key; ComponentLink5URL: https://datasheet.ciiva.com/2002/tmp175-2002987.pdf?src-supplier=Digi-Key; ComponentLink5Description: https://datasheet.ciiva.com/2002/tmp175-2002987.pdf?src-supplier=Digi-Key; ComponentLink6URL: https://datasheet.ciiva.com/1514/1836472-1514144.pdf?src-supplier=Element14; ComponentLink6Description: https://datasheet.ciiva.com/1514/1836472-1514144.pdf?src-supplier=Element14; ComponentLink7URL: https://datasheet.ciiva.com/1514/1836472-1514145.pdf?src-supplier=Element14; ComponentLink7Description: https://datasheet.ciiva.com/1514/1836472-1514145.pdf?src-supplier=Element14; Supplier Part Number 1: 296-17838-1-ND
U6 = MLX90614ESF-BAA-000-TU: Temp Sensor Digital Serial (2-Wire) 4-Pin TO-39 Can; Manufacturer: Melexis; Max Output Current: 11mA; Operating Supply Voltage: 3.6V; Resolution: 16b; Output Type: PWM; Sensing Method: Infrared (IR); Supplier 1: Digi-Key; Manufacturer Part Number: MLX90614ESF-BAA-000-TU; RoHS: Yes; Category: Temperature and Humidity Sensors; Stock 1: 1365; Case/Package: TO-39-4; Min Operating Temperature: -40°C; Max Operating Temperature: 85°C; Package Quantity: 55; Packaging: Tray; Lead Free: Lead Free; RoHS Compliant: Yes; ComponentLink1URL: http://www.mouser.com/ds/2/734/MLX90614-Datasheet-Melexis-953298.pdf?src-supplier=Mouser; ComponentLink1Description: http://www.mouser.com/ds/2/734/MLX90614-Datasheet-Melexis-953298.pdf?src-supplier=Mouser; ComponentLink2URL: https://www.melexis.com/-/media/files/documents/datasheets/mlx90614-datasheet-melexis.pdf?src-supplier=Digi-Key; ComponentLink2Description: https://www.melexis.com/-/media/files/documents/datasheets/mlx90614-datasheet-melexis.pdf?src-supplier=Digi-Key; ComponentLink3URL: http://www.melexis.com/Asset/IR-sensor-thermometer-MLX90614-Datasheet-DownloadLink-5152.aspx?src-supplier=Future+Electronics; ComponentLink3Description: http://www.melexis.com/Asset/IR-sensor-thermometer-MLX90614-Datasheet-DownloadLink-5152.aspx?src-supplier=Future+Electronics; Supplier Part Number 1: MLX90614ESF-BAA-000-TU-ND